# Altium schematic sheet bme_sensorion_board.SchDoc
size A0
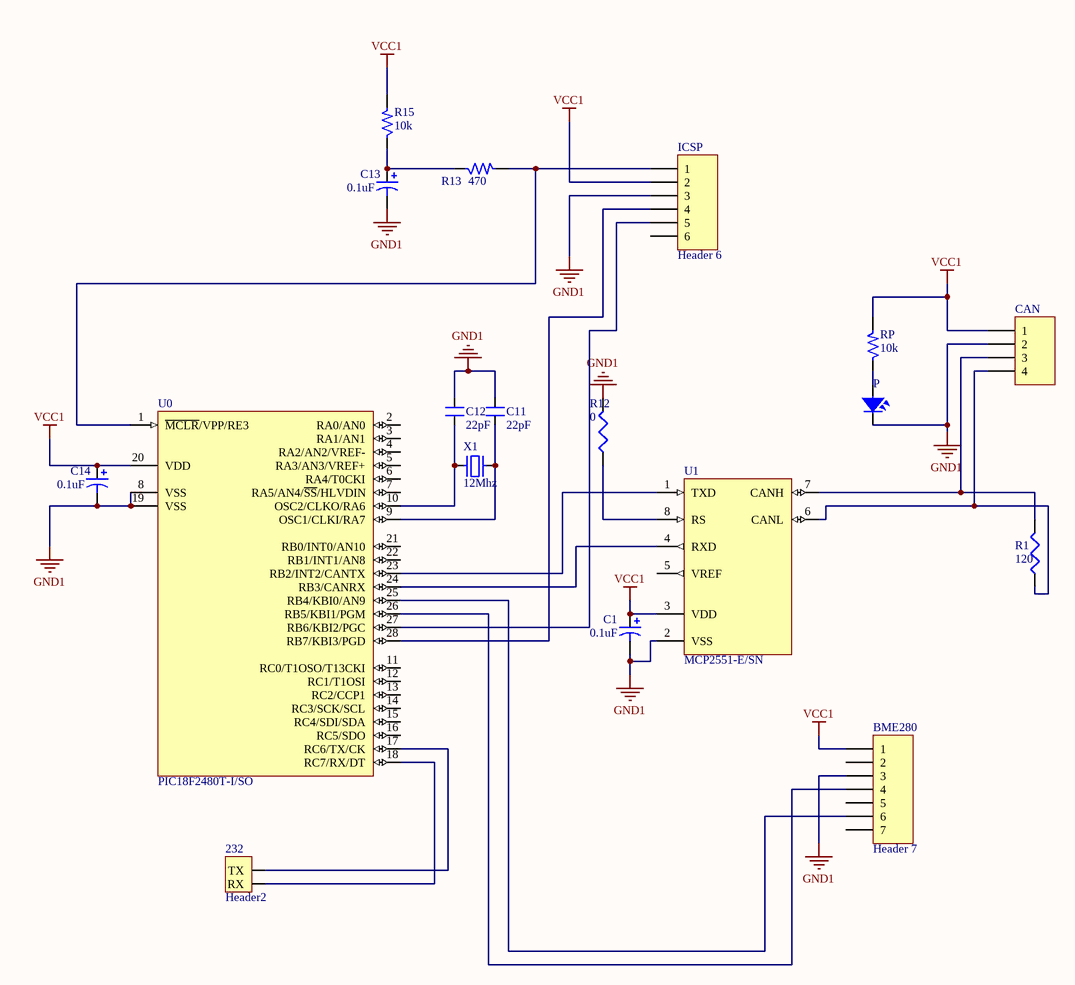
[diagram p0: bme_sensorion_board.SchDoc]

## Parts
232  Header2  [HDR2]
BME280  Header 7  [HDR1X7]
C1  value 0.1uF  [C0805]  (hidden comment: Cap Pol3)
C11  22pF  [CN1]
C12  22pF  [CN1]
C13  value 0.1uF  [C0805]  (hidden comment: Cap Pol3)
C14  value 0.1uF  [C0805]  (hidden comment: Cap Pol3)
CAN  Header 4  [HDR1X4]  (value not drawn)
ICSP  Header 6  [HDR1X6]
P  LED  [LED-3MM-YELLOW]  (value not drawn)
R1  value 120  [J1-0603]  (hidden comment: Res3)
R12  value 0  [J1-0603]  (hidden comment: Res3)
R13  470  [SM-RES-1206]
R15  10k  [SM-RES-1206]
RP  10k  [SM-RES-1206]
U0  PIC18F2480T-I/SO  [SOIC-SO28_L]
U1  MCP2551-E/SN  [SOIC-SN8_N]
X1  12Mhz  [XT2]

## Nets
GND1: BME280.3 C1.2 C11.2 C12.2 C13.2 C14.2 CAN.2 ICSP.3 P.2 R12.2 U0.8(VSS) U0.19(VSS) U1.2(VSS)
VCC1: BME280.1 C1.1 C14.1 CAN.1 ICSP.2 R15.2 RP.2 U0.20(VDD) U1.3(VDD)
Net232_1: 232.1(RX) U0.18(RC7/RX/DT)
Net232_2: 232.2(TX) U0.17(RC6/TX/CK)
NetBME280_4: BME280.4 U0.26(RB5/KBI1/PGM)
NetBME280_6: BME280.6 U0.25(RB4/KBI0/AN9)
NetC11_1: C11.1 U0.9(OSC1/CLKI/RA7) X1.2
NetC12_1: C12.1 U0.10(OSC2/CLKO/RA6) X1.1
NetC13_1: C13.1 R13.1 R15.1
NetCAN_3: CAN.3 R1.2 U1.7(CANH)
NetCAN_4: CAN.4 R1.1 U1.6(CANL)
NetICSP_1: ICSP.1 R13.2 U0.1(~{MCLR}/VPP/RE3)
NetICSP_4: ICSP.4 U0.28(RB7/KBI3/PGD)
NetICSP_5: ICSP.5 U0.27(RB6/KBI2/PGC)
NetP_1: P.1 RP.1
NetR12_1: R12.1 U1.8(RS)
NetU0_23: U0.23(RB2/INT2/CANTX) U1.1(TXD)
NetU0_24: U0.24(RB3/CANRX) U1.4(RXD)

Not connected (* = marked no-connect by the designer): BME280 2 5 7; ICSP 6; U0 2(RA0/AN0) 3(RA1/AN1) 4(RA2/AN2/VREF-) 5(RA3/AN3/VREF+) 6(RA4/T0CKI) 7(RA5/AN4/~{SS}/HLVDIN) 11(RC0/T1OSO/T13CKI) 12(RC1/T1OSI) 13(RC2/CCP1) 14(RC3/SCK/SCL) 15(RC4/SDI/SDA) 16(RC5/SDO) 21(RB0/INT0/AN10) 22(RB1/INT1/AN8); U1 5(VREF)

## Library data of the parts
232 = Header2: Header IDC, 2 x 1 Pin Vertical 2.54mm Pitch (Non-Boxed, Male); Manufacturer: W¨¹rth Elektronik eiSos GmbH; partNo: 613002143121; ComponentLink1 Description: Manufacturer; ComponentLink2 Description: Datasheet; NoPins: 02; Created Date: 29 March 2013; ComponentLink1URL: http://www.we-online.com; ComponentLink2URL: http://katalog.we-online.de/em/datasheet/6130xx143121.pdf; Created by: Karrer Zheng
BME280 = Header 7: Header, 7-Pin; LatestRevisionDate: 17-Jul-2002; LatestRevisionNote: Re-released for DXP Platform.; Publisher: Altium Limited
C1 C13 C14 = Cap Pol3: Polarized Capacitor (Surface Mount); Published: 8-Jun-2000; LatestRevisionDate: 29-May-2009; LatestRevisionNote: IPC-7351 Footprint Added.; PackageReference: C0805; Publisher: Altium Limited; PackageDescription: Chip Capacitor
C11 C12 = CN0: Cremic For Xtal 1pF => 100pF; Value: 33pF
CAN = Header 4: Header, 4-Pin; LatestRevisionDate: 17-Jul-2002; LatestRevisionNote: Re-released for DXP Platform.; Publisher: Altium Limited
ICSP = Header 6: Header, 6-Pin; LatestRevisionDate: 17-Jul-2002; LatestRevisionNote: Re-released for DXP Platform.; Publisher: Altium Limited
P = LED: LED Single colour Green and Red; Value: LED 3 ly Single Colour
R1 R12 = Res3: Resistor; Published: 8-Jun-2000; LatestRevisionDate: 29-May-2009; LatestRevisionNote: IPC-7351 Footprint Added.; PackageReference: J1-0603; Publisher: Altium Limited; PackageDescription: Chip Resistor
R13 R15 RP = R: Resistor 1/4W; Value: R1/4W - 1K
U0 = PIC18F2480T-I/SO: Enhanced Flash Microcontroller with ECAN Technology, 10-Bit A/D and nanoWatt Technology, 16K Flash, 28-Pin SOIC, Industrial Temperature Range, Tape and Reel; Published: 29-Jan-2009; LatestRevisionDate: 02-Dec-2009; LatestRevisionNote: Updated to datasheet revision D, Nov-2009; DatasheetVersion: revD, Nov-2009; PackageVersion: revBB, Aug-2009; PackageReference: SOIC-SO28; Publisher: Altium Limited; PackageDescription: 28-Lead Plastic Small Outline (SO) - Wide 7.50mm Body [SOIC]; Supplier 1: Digi-Key; Supplier Part Number 1: PIC18F2480T-I/SO-ND; Code_JEDEC: MS-013; ComponentLink1Description: Datasheet; ComponentLink1URL: http://ww1.microchip.com/downloads/en/DeviceDoc/39637d.pdf; ComponentLink2Description: Packaging Specification; ComponentLink2URL: http://www.microchip.com/stellent/groups/techpub_sg/documents/packagingspec/en012702.pdf; ComponentLink3Description: Microchip.com Home; ComponentLink3URL: http://www.microchip.com/
U1 = MCP2551-E/SN: High-Speed CAN Transceiver, 8-Pin SOIC, Extended Temperature; Published: 29-Jan-2009; DatasheetVersion: revE, Jan-2007; PackageVersion: revBB, Aug-2009; PackageReference: SOIC-SN8; Publisher: Altium Limited; PackageDescription: 8-Lead Plastic Small Outline (SN) - Narrow, 3.90mm Body [SOIC]; Supplier 1: Digi-Key; Supplier Part Number 1: MCP2551-E/SN-ND; Supplier 2: Farnell; Supplier Part Number 2: 1467746; Supplier 3: Farnell; Supplier Part Number 3: 4687887; Code_JEDEC: MS-012; Code_IPC: SOIC127P600-8; ComponentLink1Description: Datasheet; ComponentLink1URL: http://ww1.microchip.com/downloads/en/DeviceDoc/21667E.pdf; ComponentLink2Description: Packaging Specification; ComponentLink2URL: http://www.microchip.com/stellent/groups/techpub_sg/documents/packagingspec/en012702.pdf; ComponentLink3Description: Microchip.com Home; ComponentLink3URL: http://www.microchip.com/
X1 = XT2: Crystal, 32.768 KHz, -40 to 85 degC, 3.2 x 1.5 x 0.9 mm SMD; Value: 4Mhz